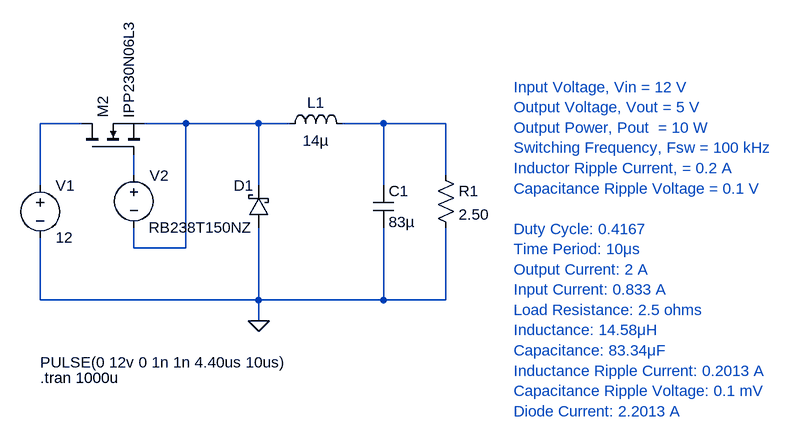
[diagram p0: schematic buck.asc]
buck.asc, the LTspice schematic file:
Version 4
SHEET 1 1176 680
WIRE -32 112 -96 112
WIRE 128 112 64 112
WIRE 240 112 128 112
WIRE 288 112 240 112
WIRE 432 112 368 112
WIRE 528 112 432 112
WIRE 48 192 48 160
WIRE 528 192 528 112
WIRE -96 208 -96 112
WIRE 240 208 240 112
WIRE 432 208 432 112
WIRE 48 304 48 272
WIRE 128 304 128 112
WIRE 128 304 48 304
WIRE -96 384 -96 288
WIRE 240 384 240 272
WIRE 240 384 -96 384
WIRE 432 384 432 272
WIRE 432 384 240 384
WIRE 528 384 528 272
WIRE 528 384 432 384
WIRE 240 416 240 384
FLAG 240 416 0
SYMBOL voltage -96 192 R0
WINDOW 123 0 0 Left 0
WINDOW 39 0 0 Left 0
SYMATTR InstName V1
SYMATTR Value 12
SYMBOL ind 272 128 R270
WINDOW 0 32 56 VTop 2
WINDOW 3 5 56 VBottom 2
SYMATTR InstName L1
SYMATTR Value 14µ
SYMBOL schottky 256 272 R180
WINDOW 0 24 64 Left 2
WINDOW 3 24 0 Left 2
SYMATTR InstName D1
SYMATTR Value RB238T150NZ
SYMATTR Description Diode
SYMATTR Type diode
SYMBOL nmos -32 160 R270
SYMATTR InstName M2
SYMATTR Value IPP230N06L3
SYMBOL res 512 176 R0
SYMATTR InstName R1
SYMATTR Value 2.50
SYMBOL voltage 48 176 R0
WINDOW 123 0 0 Left 0
WINDOW 39 0 0 Left 0
WINDOW 3 -144 304 Left 2
SYMATTR InstName V2
SYMATTR Value PULSE(0 12v 0 1n 1n 4.40us 10us)
SYMBOL cap 416 208 R0
SYMATTR InstName C1
SYMATTR Value 83µ
TEXT -96 504 Left 2 !.tran 1000u
TEXT 632 56 Left 2 ;Input Voltage, Vin = 12 V\nOutput Voltage, Vout = 5 V\nOutput Power, Pout  = 10 W\nSwitching Frequency, Fsw = 100 kHz\nInductor Ripple Current, = 0.2 A\nCapacitance Ripple Voltage = 0.1 V\n \nDuty Cycle: 0.4167\nTime Period: 10μs \nOutput Current: 2 A\nInput Current: 0.833 A\nLoad Resistance: 2.5 ohms\nInductance: 14.58μH\nCapacitance: 83.34μF\nInductance Ripple Current: 0.2013 A\nCapacitance Ripple Voltage: 0.1 mV\nDiode Current: 2.2013 A

The netlist it stands for:
* buck.asc
V1 N001 0 12
L1 N002 N003 14µ
D1 0 N002 RB238T150NZ
M2 N001 N004 N002 N002 IPP230N06L3
R1 N003 0 2.50
V2 N004 N002 PULSE(0 12v 0 1n 1n 4.40us 10us)
C1 N003 0 83µ
.model D D
.lib standard.dio
.model NMOS NMOS
.model PMOS PMOS
.lib standard.mos
.tran 1000u
* Input Voltage, Vin = 12 V
* Output Voltage, Vout = 5 V
* Output Power, Pout  = 10 W
* Switching Frequency, Fsw = 100 kHz
* Inductor Ripple Current, = 0.2 A
* Capacitance Ripple Voltage = 0.1 V
* Duty Cycle: 0.4167
* Time Period: 10μs
* Output Current: 2 A
* Input Current: 0.833 A
* Load Resistance: 2.5 ohms
* Inductance: 14.58μH
* Capacitance: 83.34μF
* Inductance Ripple Current: 0.2013 A
* Capacitance Ripple Voltage: 0.1 mV
* Diode Current: 2.2013 A
.backanno
.end

* Results of the author's LTspice run, read from the files saved beside the schematic
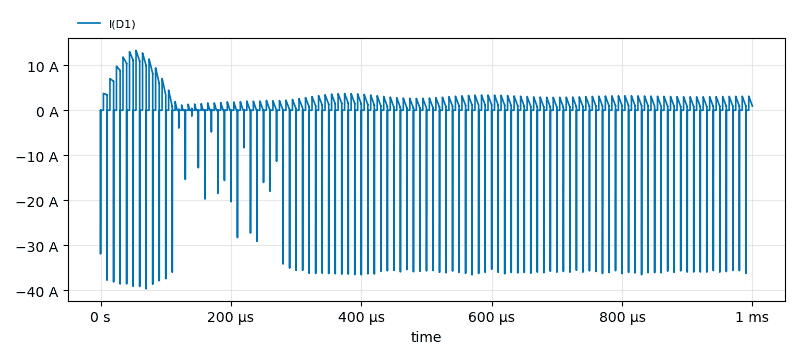
[diagram p1: Transient Analysis of buck.asc, plotted from the saved traces]
* Transient Analysis, 1 run:
*   I(D1): min -39.93 A, max 13.32 A, average 1.376 A, rms 2.618 A, last 944 mA